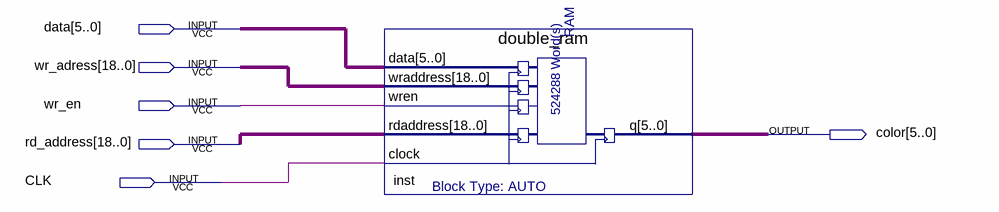
[diagram p0: schematic sheet]
// Quartus schematic display_block.bdf as structural Verilog: 1 symbols, 6 pins
module display_block (
  input  [5:0] data,
  input  [18:0] wr_adress,
  input  wr_en,
  input  [18:0] rd_address,
  input  CLK,
  output [5:0] color
);

  double_ram inst (.data(data), .wraddress(wr_adress), .wren(wr_en), .rdaddress(rd_address), .clock(CLK), .q(color));
endmodule
